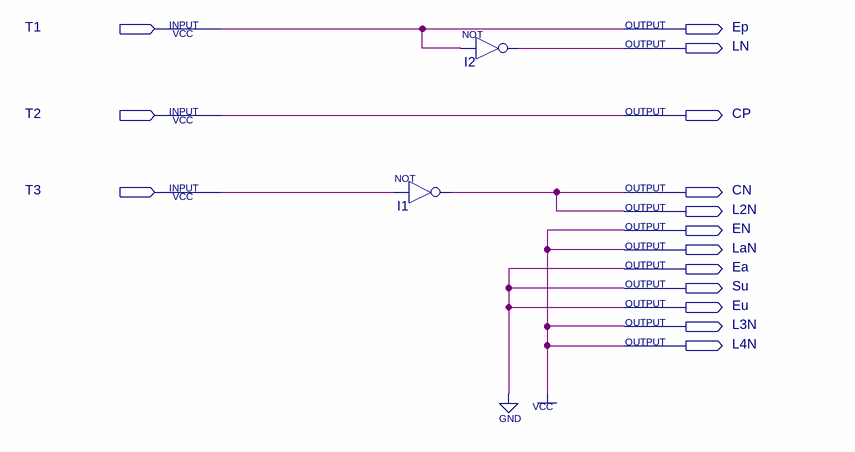
[diagram p0: schematic sheet]
// Quartus schematic Ciclo-Busca.bdf as structural Verilog: 2 symbols, 15 pins
module \Ciclo-Busca  (
  input  T1,
  input  T2,
  input  T3,
  output Ep,
  output LN,
  output CP,
  output CN,
  output L2N,
  output EN,
  output LaN,
  output Ea,
  output Su,
  output Eu,
  output L3N,
  output L4N
);

  not I1 (CN, T3);
  not I2 (LN, T1);

  assign CP = T2;
  assign Ea = 1'b0;
  assign EN = 1'b1;
  assign Ep = T1;
  assign Eu = 1'b0;
  assign L2N = CN;
  assign L3N = 1'b1;
  assign L4N = 1'b1;
  assign LaN = 1'b1;
  assign Su = 1'b0;
endmodule
